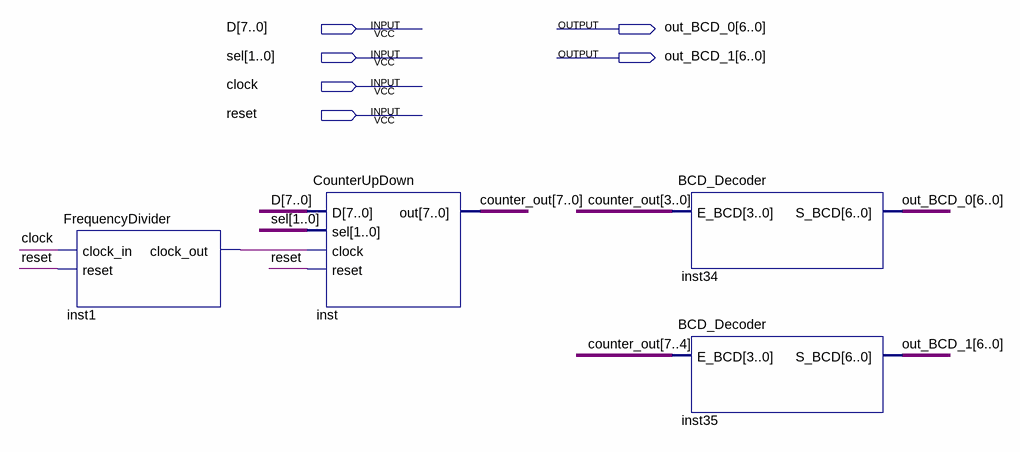
[diagram p0: schematic sheet]
// Quartus schematic CounterUpDownBCD.bdf as structural Verilog: 4 symbols, 6 pins
module CounterUpDownBCD (
  input  [7:0] D,
  input  [1:0] sel,
  input  clock,
  input  reset,
  output [6:0] out_BCD_0,
  output [6:0] out_BCD_1
);

  wire inst1_clock_out;
  wire [7:0] counter_out;

  FrequencyDivider inst1 (.clock_in(clock), .reset(reset), .clock_out(inst1_clock_out));
  CounterUpDown inst (.D(D), .sel(sel), .clock(inst1_clock_out), .reset(reset), .out(counter_out));
  BCD_Decoder inst34 (.E_BCD(counter_out[3:0]), .S_BCD(out_BCD_0));
  BCD_Decoder inst35 (.E_BCD(counter_out[7:4]), .S_BCD(out_BCD_1));
endmodule
